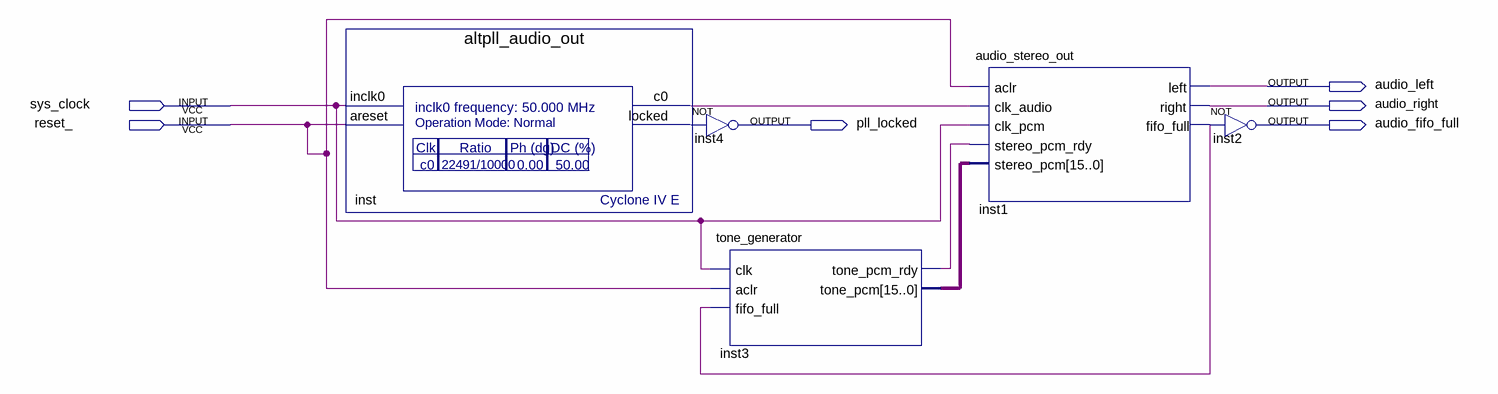
[diagram p0: schematic sheet]
// Quartus schematic audioX.bdf as structural Verilog: 5 symbols, 6 pins
module audioX (
  input  sys_clock,
  input  reset_,
  output audio_left,
  output audio_right,
  output pll_locked,
  output audio_fifo_full
);

  wire inst1_fifo_full, inst3_tone_pcm_rdy, inst_c0, inst_locked;
  wire [15:0] inst3_tone_pcm;

  altpll_audio_out inst (.inclk0(sys_clock), .areset(reset_), .c0(inst_c0), .locked(inst_locked));
  not inst4 (pll_locked, inst_locked);
  tone_generator inst3 (
    .clk(sys_clock), .aclr(reset_), .fifo_full(inst1_fifo_full), .tone_pcm_rdy(inst3_tone_pcm_rdy),
    .tone_pcm(inst3_tone_pcm));
  audio_stereo_out inst1 (
    .aclr(reset_), .clk_audio(inst_c0), .clk_pcm(sys_clock), .stereo_pcm_rdy(inst3_tone_pcm_rdy),
    .stereo_pcm(inst3_tone_pcm), .left(audio_left), .right(audio_right), .fifo_full(inst1_fifo_full));
  not inst2 (audio_fifo_full, inst1_fifo_full);
endmodule
